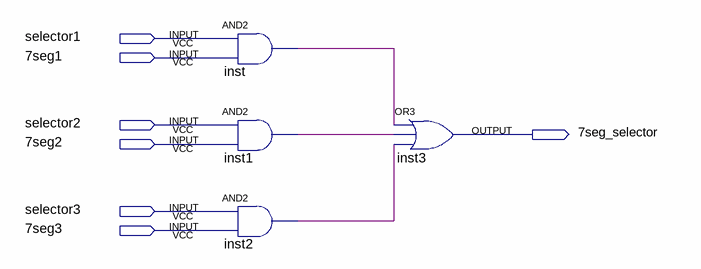
[diagram p0: schematic sheet]
// Quartus schematic seletor_7seg.bdf as structural Verilog: 4 symbols, 7 pins
module seletor_7seg (
  input  selector1,
  input  \7seg1 ,
  input  selector2,
  input  \7seg2 ,
  input  selector3,
  input  \7seg3 ,
  output \7seg_selector 
);

  wire inst1_out, inst2_out, inst_out;

  and inst (inst_out, selector1, \7seg1 );
  and inst1 (inst1_out, selector2, \7seg2 );
  and inst2 (inst2_out, selector3, \7seg3 );
  or inst3 (\7seg_selector , inst_out, inst1_out, inst2_out);
endmodule
